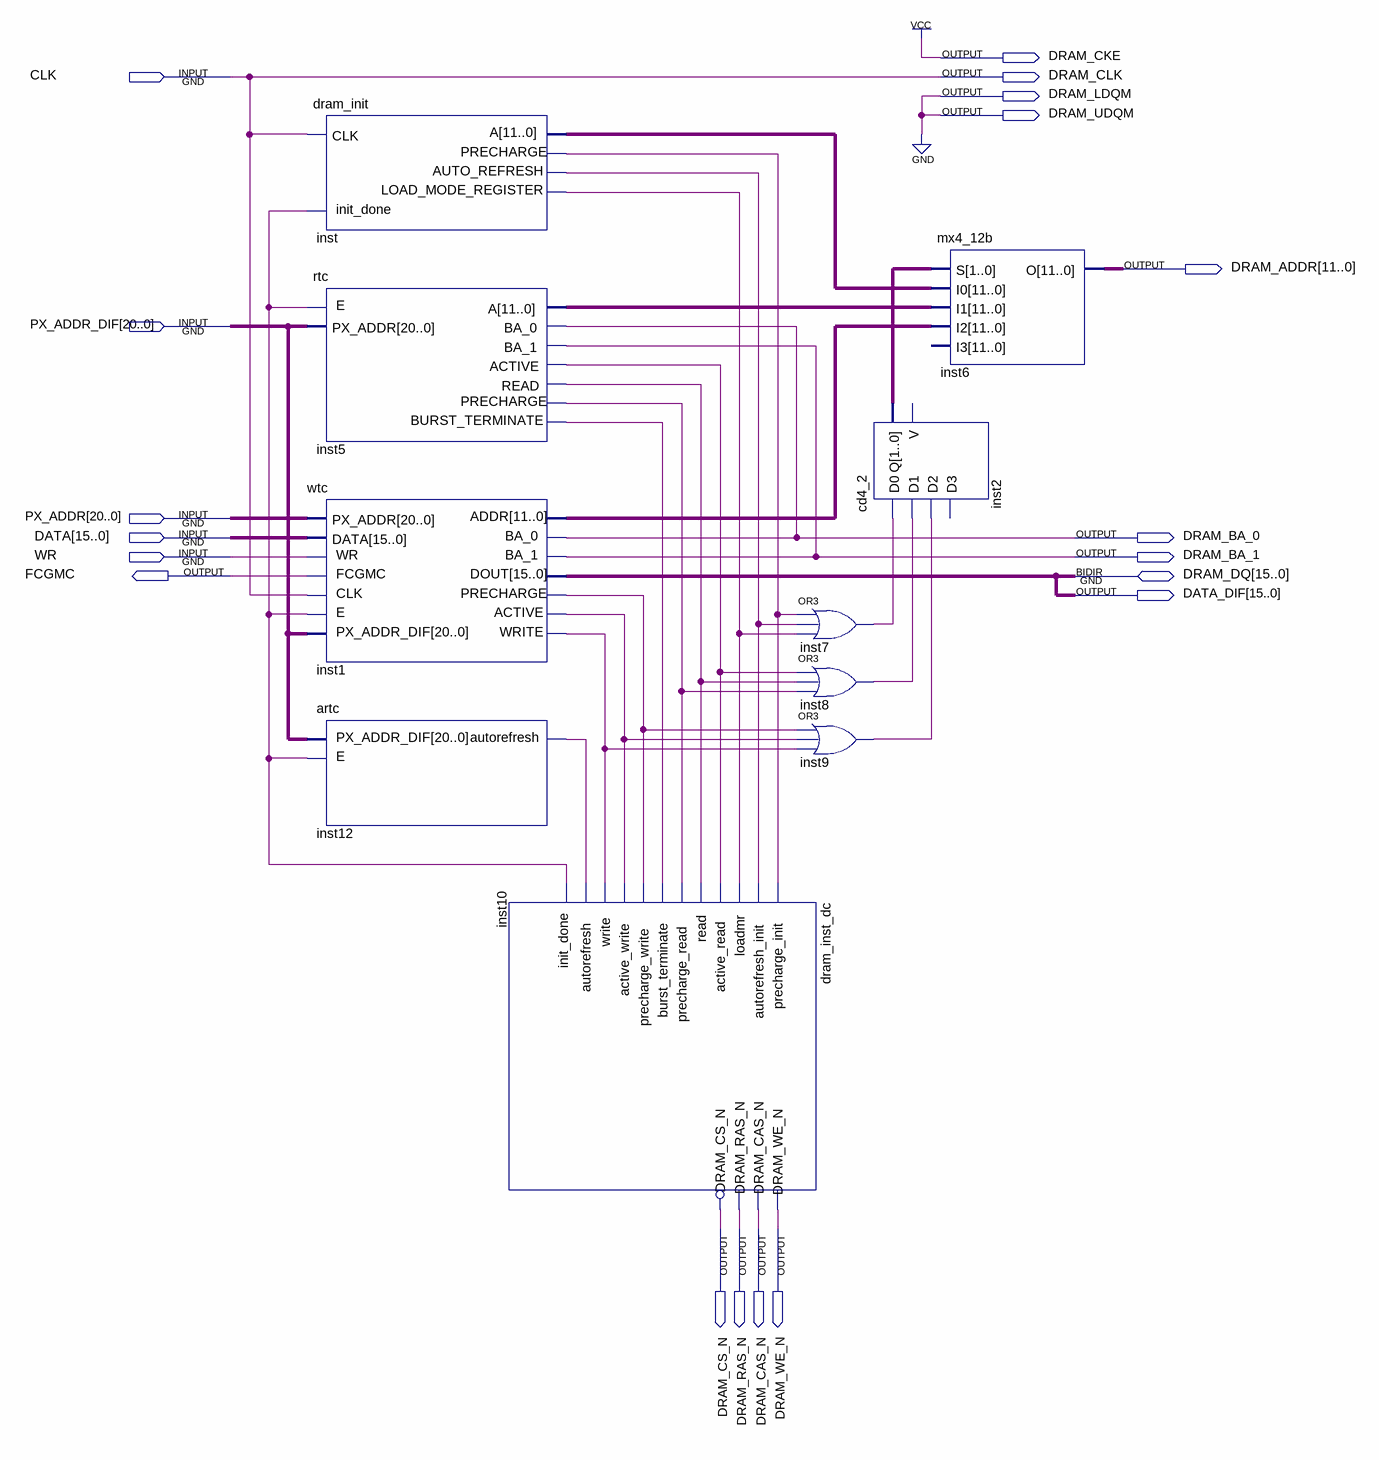
[diagram p0: schematic sheet]
// Quartus schematic gmc.bdf as structural Verilog: 10 symbols, 19 pins
module gmc (
  input  CLK,
  input  [20:0] PX_ADDR_DIF,
  input  [20:0] PX_ADDR,
  input  [15:0] DATA,
  input  WR,
  inout  [15:0] DRAM_DQ,
  output DRAM_CKE,
  output DRAM_CLK,
  output DRAM_LDQM,
  output DRAM_UDQM,
  output [11:0] DRAM_ADDR,
  output DRAM_BA_0,
  output DRAM_BA_1,
  output FCGMC,
  output [15:0] DATA_DIF,
  output DRAM_CS_N,
  output DRAM_RAS_N,
  output DRAM_CAS_N,
  output DRAM_WE_N
);

  wire inst1_active, inst1_precharge, inst1_write, inst5_active, inst5_burst_terminate, inst5_precharge,
       inst5_read, inst7_out, inst8_out, inst9_out, inst10_dram_cs_n, inst12_autorefresh, inst_auto_refresh,
       inst_init_done, inst_load_mode_register, inst_precharge;
  wire [1:0] inst2_q;
  wire [11:0] inst1_addr, inst5_a, inst_a;

  dram_init inst (
    .CLK(CLK), .init_done(inst_init_done), .PRECHARGE(inst_precharge), .AUTO_REFRESH(inst_auto_refresh),
    .LOAD_MODE_REGISTER(inst_load_mode_register), .A(inst_a));
  rtc inst5 (
    .PX_ADDR(PX_ADDR_DIF), .E(inst_init_done), .ACTIVE(inst5_active), .READ(inst5_read),
    .PRECHARGE(inst5_precharge), .A(inst5_a), .BA_0(DRAM_BA_0), .BA_1(DRAM_BA_1),
    .BURST_TERMINATE(inst5_burst_terminate));
  wtc inst1 (
    .PX_ADDR(PX_ADDR), .DATA(DATA), .CLK(CLK), .E(inst_init_done), .PX_ADDR_DIF(PX_ADDR_DIF), .WR(WR),
    .DOUT(DRAM_DQ), .WRITE(inst1_write), .FCGMC(FCGMC), .BA_0(DRAM_BA_0), .BA_1(DRAM_BA_1),
    .PRECHARGE(inst1_precharge), .ACTIVE(inst1_active), .ADDR(inst1_addr));
  artc inst12 (.PX_ADDR_DIF(PX_ADDR_DIF), .E(inst_init_done), .autorefresh(inst12_autorefresh));
  dram_inst_dc inst10 (
    .init_done(inst_init_done), .precharge_init(inst_precharge), .precharge_read(inst5_precharge),
    .read(inst5_read), .loadmr(inst_load_mode_register), .write(inst1_write),
    .precharge_write(inst1_precharge), .active_read(inst5_active), .active_write(inst1_active),
    .autorefresh_init(inst_auto_refresh), .autorefresh(inst12_autorefresh),
    .burst_terminate(inst5_burst_terminate), .DRAM_WE_N(DRAM_WE_N), .DRAM_CAS_N(DRAM_CAS_N),
    .DRAM_RAS_N(DRAM_RAS_N), .DRAM_CS_N(inst10_dram_cs_n));
  not inst10_DRAM_CS_N_inverted (DRAM_CS_N, inst10_dram_cs_n);
  or inst7 (inst7_out, inst_precharge, inst_auto_refresh, inst_load_mode_register);
  or inst8 (inst8_out, inst5_active, inst5_read, inst5_precharge);
  or inst9 (inst9_out, inst1_precharge, inst1_active, inst1_write);
  cd4_2 inst2 (.D0(inst7_out), .D1(inst8_out), .D2(inst9_out), .Q(inst2_q));  // open: D3, V
  mx4_12b inst6 (.S(inst2_q), .I0(inst_a), .I1(inst5_a), .I2(inst1_addr), .O(DRAM_ADDR));  // open: I3

  assign DATA_DIF = DRAM_DQ;
  assign DRAM_CKE = 1'b1;
  assign DRAM_CLK = CLK;
  assign DRAM_LDQM = 1'b0;
  assign DRAM_UDQM = 1'b0;
endmodule
